# Altium schematic sheet TopSheet.SchDoc: Fisioremoto V2
size A4; DrawnBy: Lautaro Petrauskas; Organization: GIBIO; Revision: 1.0
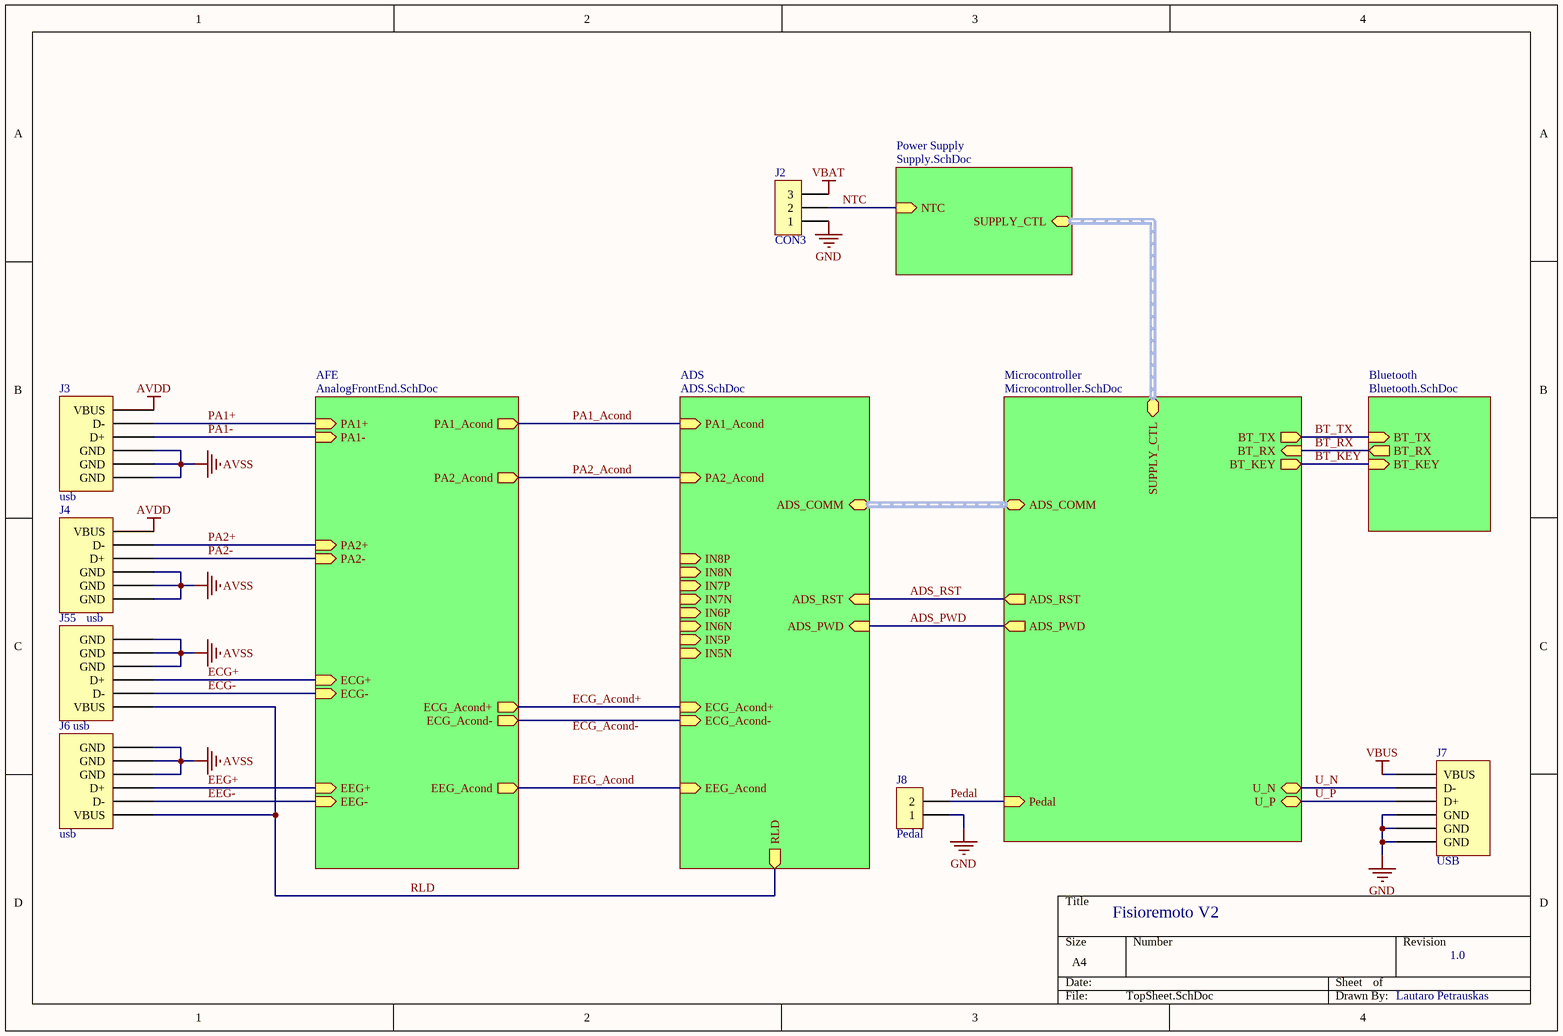
[diagram p0: TopSheet.SchDoc]

## Parts
J2  CON3  [SIP3]
J3  usb  [USB_Mini_TipoB]
J4  usb  [USB_Mini_TipoB]
J6  usb  [USB_Mini_TipoB]
J7  USB  [USB_Micro-B_USB]
J8  value Pedal  [SIP2]  (hidden comment: CON2)
J55  usb  [USB_Mini_TipoB]

## Sub-sheets
ADS = ADS.SchDoc: PA1_Acond (in), PA2_Acond (in), ECG_Acond+ (in), ECG_Acond- (in), EEG_Acond (in), RLD (out), ADS_RST (in), ADS_PWD (in), ADS_COMM (harness SPI), IN7P (in), IN6P (in), IN8P (in), IN7N (in), IN8N (in), IN5P (in), IN6N (in), IN5N (in)
AFE = AnalogFrontEnd.SchDoc: PA1+ (in), PA1- (in), PA1_Acond (out), PA2_Acond (out), PA2+ (in), PA2- (in), ECG+ (in), ECG- (in), ECG_Acond+ (out), ECG_Acond- (out), EEG_Acond (out), EEG+ (in), EEG- (in)
Bluetooth = Bluetooth.SchDoc: BT_TX (in), BT_RX (out), BT_KEY (in)
Microcontroller = Microcontroller.SchDoc: ADS_RST (out), ADS_PWD (out), BT_TX (out), BT_RX (in), BT_KEY (out), Pedal (in), ADS_COMM (harness SPI), U_P (bidir), U_N (bidir), SUPPLY_CTL (harness Supply)
Power Supply = Supply.SchDoc: NTC (in), SUPPLY_CTL (harness Supply)

## Nets
AVDD: J3.1(VBUS) J4.1(VBUS)
AVSS: J3.4(GND) J3.5(GND) J3.6(GND) J4.4(GND) J4.5(GND) J4.6(GND) J6.4(GND) J6.5(GND) J6.6(GND) J55.4(GND) J55.5(GND) J55.6(GND)
GND: J2.1 J7.4(GND) J7.5(GND) J7.6(GND) J8.1
VBAT: J2.3
VBUS: J7.1(VBUS)
ADS_PWD: sheet ADS/ADS_PWD, sheet Microcontroller/ADS_PWD
ADS_RST: sheet ADS/ADS_RST, sheet Microcontroller/ADS_RST
BT_KEY: sheet Microcontroller/BT_KEY, sheet Bluetooth/BT_KEY
BT_RX: sheet Microcontroller/BT_RX, sheet Bluetooth/BT_RX
BT_TX: sheet Microcontroller/BT_TX, sheet Bluetooth/BT_TX
ECG+: J55.3(D+) ; sheet AFE/ECG+
ECG-: J55.2(D-) ; sheet AFE/ECG-
ECG_Acond+: sheet AFE/ECG_Acond+, sheet ADS/ECG_Acond+
EEG+: J6.3(D+) ; sheet AFE/EEG+
EEG-: J6.2(D-) ; sheet AFE/EEG-
EEG_Acond: sheet AFE/EEG_Acond, sheet ADS/EEG_Acond
NTC: J2.2 ; sheet Power Supply/NTC
PA1+: J3.2(D-) ; sheet AFE/PA1+
PA1-: J3.3(D+) ; sheet AFE/PA1-
PA1_Acond: sheet AFE/PA1_Acond, sheet ADS/PA1_Acond
PA2+: J4.2(D-) ; sheet AFE/PA2+
PA2-: J4.3(D+) ; sheet AFE/PA2-
PA2_Acond: sheet AFE/PA2_Acond, sheet ADS/PA2_Acond
Pedal: J8.2 ; sheet Microcontroller/Pedal
RLD: J6.1(VBUS) J55.1(VBUS) ; sheet ADS/RLD
U_N: J7.2(D-) ; sheet Microcontroller/U_N
U_P: J7.3(D+) ; sheet Microcontroller/U_P
(unnamed): sheet AFE/ECG_Acond-, sheet ADS/ECG_Acond-

## Buses and harness runs
harness sheet ADS/ADS_COMM = sheet Microcontroller/ADS_COMM
harness sheet Microcontroller/SUPPLY_CTL = sheet Power Supply/SUPPLY_CTL

## Notes on the sheet
- Labels drawn without touching a wire or pin: ECG_Acond-

## Library data of the parts
J3 J4 J6 J55 = USB_Mini